# Altium schematic sheet RF.SchDoc: RF
size A4; ApprovedBy: Maduranga Mathara Arachchi; CheckedBy: Maduranga Mathara Arachchi; Author: Maduranga Mathara Arachchi; CompanyName: Maduranga Mathara Arachchi; DrawnBy: Maduranga Mathara Arachchi; Engineer: Maduranga Mathara Arachchi; Organization: Maduranga Mathara Arachchi; Address1: 17/21, Gnanawimala Road,; Address2: Athurugiriya; Address3: Colombo,; Address4: Sri Lanka.; DocumentNumber: 1; Revision: 0.1; SheetNumber: 7; SheetTotal: 7
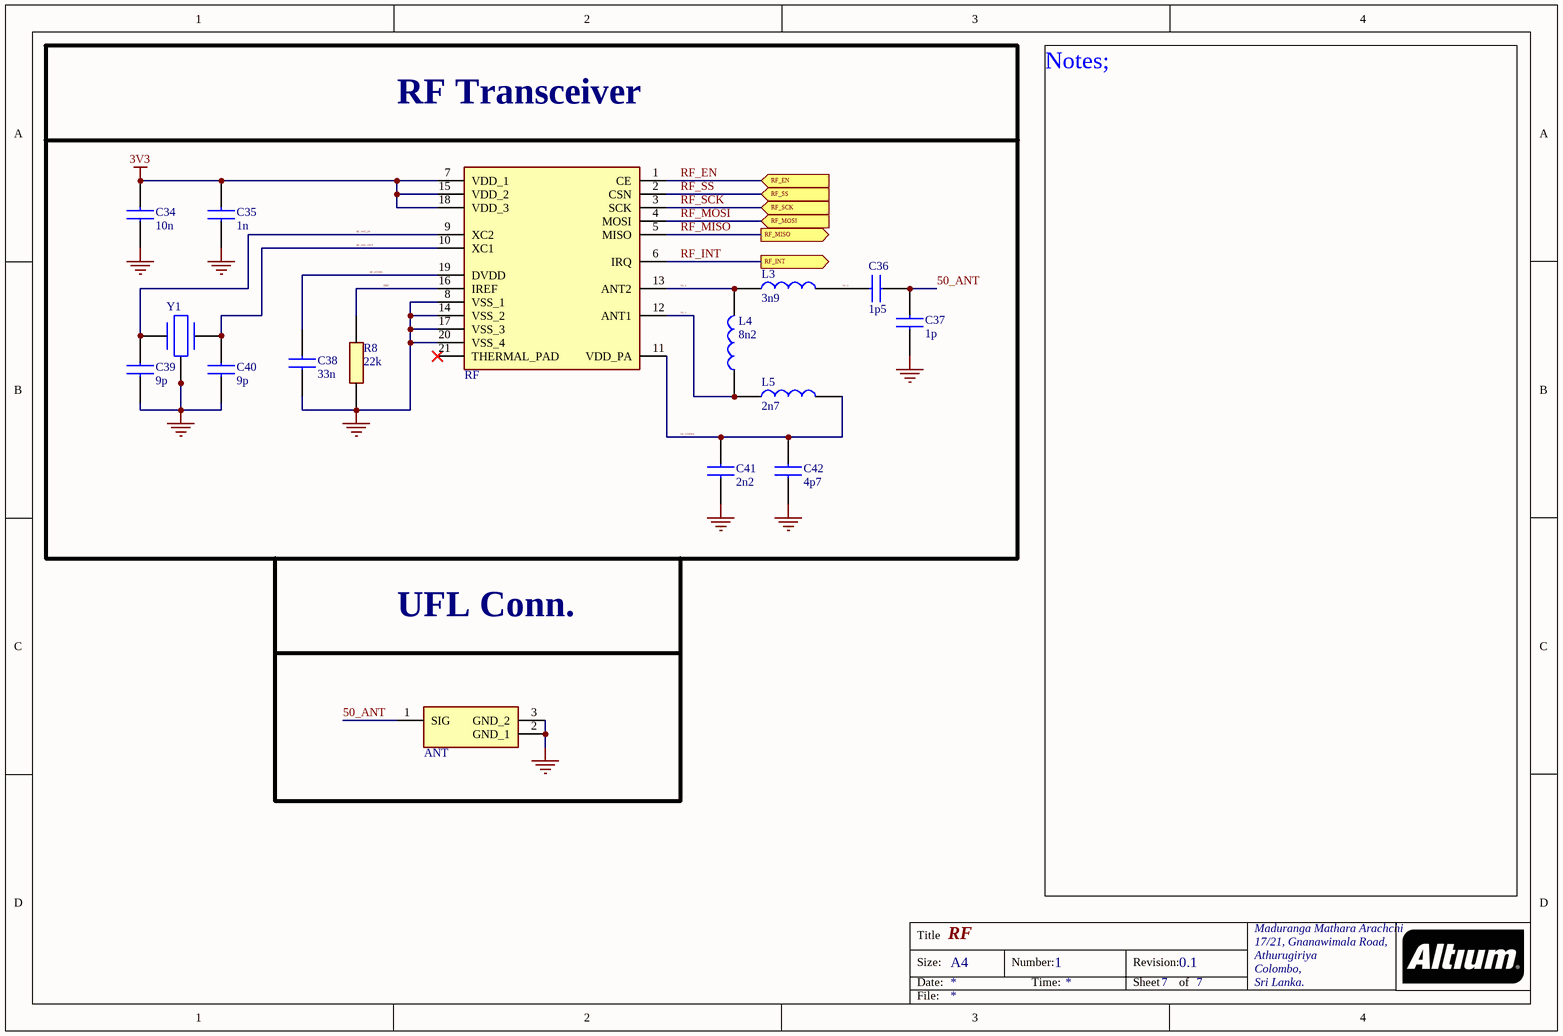
[diagram p0: RF.SchDoc]

## Parts
ANT  CONUFL001-SMD-T  [CONUFL001SMDT]  (value not drawn)
C34  10n  [C0402C104J4RACTU]
C35  1n  [C0402C104J4RACTU]
C36  1p5  [CAPC1005X70N]
C37  1p  [CAPC1005X70N]
C38  33n  [CAPC1005X70N]
C39  9p  [CAPC1005X70N]
C40  9p  [CAPC1005X70N]
C41  2n2  [CAPC1005X56N]
C42  4p7  [CAPC1005X70N]
L3  3n9  [LQW15AN10NG80D]
L4  8n2  [LQG15WH0N7B02D]
L5  2n7  [LQW15CNR20J00B]
R8  22k  [ERJ2RKD1004X]
RF  NRF24L01P-R7  [QFN50P400X400X95-21N-D]  (value not drawn)
Y1  TSX-3225_16.0000MF18X-AC0  [TSX3225160000MF18XAC0]  (value not drawn)

## Blocks framed on the sheet
RF Transceiver: C34-C42 L3-L5 R8 RF Y1

## Ports
RF_EN (in), RF_INT (out), RF_MISO (out), RF_MOSI (in), RF_SCK (in), RF_SS (in)

## Nets
3V3: C34.2 C35.2 RF.7(VDD_1) RF.15(VDD_2) RF.18(VDD_3)
GND: ANT.2(GND_1) ANT.3(GND_2) C34.1 C35.1 C37.1 C38.1 C39.1 C40.1 C41.1 C42.1 R8.1 RF.8(VSS_1) RF.14(VSS_2) RF.17(VSS_3) RF.20(VSS_4) Y1.2(GND_1) Y1.4(GND_2)
50_1: L4.1 L5.1 RF.12(ANT1)
50_2: L3.1 L4.2 RF.13(ANT2)
50_3: C36.1 L3.2
50_ANT: ANT.1(SIG) C36.2 C37.2
50_VDDPA: C41.2 C42.2 L5.2 RF.11(VDD_PA)
IREF: R8.2 RF.16(IREF)
RF_DVDD: C38.2 RF.19(DVDD)
RF_EN: RF.1(CE) ; port RF_EN
RF_INT: RF.6(IRQ) ; port RF_INT
RF_MISO: RF.5(MISO) ; port RF_MISO
RF_MOSI: RF.4(MOSI) ; port RF_MOSI
RF_OSC_IN: C39.2 RF.9(XC2) Y1.1(CRYSTAL_1)
RF_OSC_OUT: C40.2 RF.10(XC1) Y1.3(CRYSTAL_2)
RF_SCK: RF.3(SCK) ; port RF_SCK
RF_SS: RF.2(CSN) ; port RF_SS

Not connected (* = marked no-connect by the designer): RF 21(THERMAL_PAD)*

## Notes on the sheet
- UFL Conn.
- Notes;
- Title
- Size:
- Date:
- A4
- Number:
- Time:
- Revision:
- Sheet
- of
- File:

## Library data of the parts
ANT = CONUFL001-SMD-T: Connector; Manufacturer_Name: TE Connectivity; Datasheet Link: https://eu.mouser.com/datasheet/2/418/9/ENG_DS_CONUFL001_SMD_T_B-3238717.pdf; Height: 1.3mm; Manufacturer_Part_Number: CONUFL001-SMD-T; Mouser Part Number: N/A; Mouser Price/Stock: https://www.mouser.co.uk/ProductDetail/TE-Connectivity/CONUFL001-SMD-T?qs=3Rah4i%252BhyCHmRzMH%252BkLkPQ%3D%3D; Arrow Part Number: CONUFL001-SMD-T; Arrow Price/Stock: https://www.arrow.com/en/products/conufl001-smd-t/te-connectivity?utm_currency=USD&region=europe
C34 = C0402C103K3RECTU: Capacitor; Manufacturer_Name: KEMET; Datasheet Link: https://content.kemet.com/datasheets/KEM_C1002_X7R_SMD.pdf; Height: 0.55mm; Manufacturer_Part_Number: C0402C103K3RECTU
C35 = C0402C102K3RAC: Capacitor; Manufacturer_Name: KEMET; Datasheet Link: https://content.kemet.com/datasheets/KEM_C1002_X7R_SMD.pdf; Height: 0.55mm; Manufacturer_Part_Number: C0402C102K3RAC; Mouser Part Number: 80-C0402C102K3RAC; Mouser Price/Stock: https://www.mouser.co.uk/ProductDetail/KEMET/C0402C102K3RAC?qs=zlI8QACJnq%252BQ2zM2nES6Og%3D%3D; Arrow Part Number: C0402C102K3RAC; Arrow Price/Stock: https://www.arrow.com/en/products/c0402c102k3rac/kemet-corporation
C36 = GRM1555C1E1R5BA01D: Capacitor; Manufacturer_Name: Murata Electronics; Datasheet Link: https://search.murata.co.jp/Ceramy/image/img/A01X/G101/ENG/GRM1555C1E1R5BA01-01A.pdf; Height: 0.7mm; Manufacturer_Part_Number: GRM1555C1E1R5BA01D; Arrow Part Number: GRM1555C1E1R5BA01D; Arrow Price/Stock: https://www.arrow.com/en/products/grm1555c1e1r5ba01d/murata-manufacturing
C37 = GRM1555C1E1R0BA01D: Capacitor; Manufacturer_Name: Murata Electronics; Datasheet Link: https://search.murata.co.jp/Ceramy/image/img/A01X/G101/ENG/GRM1555C1E1R0BA01-01A.pdf; Height: 0.7mm; Manufacturer_Part_Number: GRM1555C1E1R0BA01D; Mouser Part Number: 81-GRM1555C1E1R0BA1D; Mouser Price/Stock: https://www.mouser.com/Search/Refine.aspx?Keyword=81-GRM1555C1E1R0BA1D; Arrow Part Number: GRM1555C1E1R0BA01D; Arrow Price/Stock: https://www.arrow.com/en/products/grm1555c1e1r0ba01d/murata-manufacturing
C38 = GRM155R71E333KA88D: Capacitor; Manufacturer_Name: Murata Electronics; Datasheet Link: https://search.murata.co.jp/Ceramy/image/img/A01X/G101/ENG/GRM155R71E333KA88-01A.pdf; Height: 0.7mm; Manufacturer_Part_Number: GRM155R71E333KA88D; Mouser Part Number: 81-GRM155R71E333KA8D; Mouser Price/Stock: https://www.mouser.com/Search/Refine.aspx?Keyword=81-GRM155R71E333KA8D; Arrow Part Number: GRM155R71E333KA88D; Arrow Price/Stock: https://www.arrow.com/en/products/grm155r71e333ka88d/murata-manufacturing?region=nac
C39 C40 = GRM1555C1E9R0WA01J: Capacitor; Manufacturer_Name: Murata Electronics; Datasheet Link: http://www.murata.com/~/media/webrenewal/support/library/catalog/products/capacitor/mlcc/c02e.pdf; Height: 0.7mm; Manufacturer_Part_Number: GRM1555C1E9R0WA01J
C41 = 04023C222KAT2A: Capacitor; Manufacturer_Name: Kyocera AVX; Datasheet Link: http://www.mouser.com/catalog/supplier/library/pdf/AVXSurfaceMountCeramic.pdf; Height: 0.56mm; Manufacturer_Part_Number: 04023C222KAT2A; Mouser Part Number: 581-04023C222KAT2A; Mouser Price/Stock: https://www.mouser.co.uk/ProductDetail/KYOCERA-AVX/04023C222KAT2A?qs=KeJ6wBBJrrorroMRPCeIVQ%3D%3D; Arrow Part Number: 04023C222KAT2A; Arrow Price/Stock: https://www.arrow.com/en/products/04023c222kat2a/avx?utm_currency=USD&region=nac
C42 = GRM1555C1E4R7BA01D: Capacitor; Manufacturer_Name: Murata Electronics; Datasheet Link: https://search.murata.co.jp/Ceramy/image/img/A01X/G101/ENG/GRM1555C1E4R7BA01-01A.pdf; Height: 0.7mm; Manufacturer_Part_Number: GRM1555C1E4R7BA01D; Mouser Part Number: 81-GRM1555C1E4R7BA1D; Mouser Price/Stock: https://www.mouser.co.uk/ProductDetail/Murata-Electronics/GRM1555C1E4R7BA01D?qs=ouTquLLW2S4mxqzIU81JVw%3D%3D; Arrow Part Number: GRM1555C1E4R7BA01D; Arrow Price/Stock: https://www.arrow.com/en/products/grm1555c1e4r7ba01d/murata-manufacturing?region=nac
L3 = LQW15AN3N9G80D: Inductor; Manufacturer_Name: Murata Electronics; Datasheet Link: https://search.murata.co.jp/Ceramy/image/img/P02/JELF243A-0100.pdf; Height: 0.6mm; Manufacturer_Part_Number: LQW15AN3N9G80D; Mouser Part Number: 81-LQW15AN3N9G80D; Mouser Price/Stock: https://www.mouser.co.uk/ProductDetail/Murata-Electronics/LQW15AN3N9G80D?qs=QzBtWTOodeVJ47BgUNTlYA%3D%3D
L4 = LQG15HS8N2G02D: Inductor; Manufacturer_Name: Murata Electronics; Datasheet Link: https://search.murata.co.jp/Ceramy/image/img/P02/JELF243B-0010.pdf; Height: 0.6mm; Manufacturer_Part_Number: LQG15HS8N2G02D; Mouser Part Number: 81-LQG15HS8N2G02D; Mouser Price/Stock: https://www.mouser.co.uk/ProductDetail/Murata-Electronics/LQG15HS8N2G02D?qs=d0WKAl%252BL4KapDveqKJ4FDA%3D%3D
L5 = LQW15AN2N7G8ZD: Inductor; Manufacturer_Name: Murata Electronics; Datasheet Link: https://search.murata.co.jp/Ceramy/image/img/P02/JELF243A-9138.pdf; Height: 0.6mm; Manufacturer_Part_Number: LQW15AN2N7G8ZD; Mouser Part Number: 81-LQW15AN2N7G8ZD; Mouser Price/Stock: https://www.mouser.com/Search/Refine.aspx?Keyword=81-LQW15AN2N7G8ZD
R8 = ERJ-2RKF2202X: Resistor; Manufacturer_Name: Panasonic; Datasheet Link: https://industrial.panasonic.com/cdbs/www-data/pdf/RDA0000/AOA0000C86.pdf; Height: 0.4mm; Manufacturer_Part_Number: ERJ-2RKF2202X; Mouser Part Number: 667-ERJ-2RKF2202X; Mouser Price/Stock: https://www.mouser.co.uk/ProductDetail/Panasonic/ERJ-2RKF2202X?qs=YMBIwoNQYdW1VNg8fYH1Ug%3D%3D; Arrow Part Number: ERJ-2RKF2202X; Arrow Price/Stock: https://www.arrow.com/en/products/erj-2rkf2202x/panasonic?region=europe
RF = NRF24L01P-R7: Integrated Circuit; Manufacturer_Name: Nordic Semiconductor; Datasheet Link: https://www.mouser.com/ds/2/297/nRF24L01P-1187709.pdf; Height: 0.95mm; Manufacturer_Part_Number: NRF24L01P-R7; Mouser Part Number: 949-NRF24L01P-R7; Mouser Price/Stock: https://www.mouser.co.uk/ProductDetail/Nordic-Semiconductor/nRF24L01P-R7?qs=yd0qOhnSiDe8zMRXiZkGiQ%3D%3D; Arrow Part Number: NRF24L01P-R7; Arrow Price/Stock: https://www.arrow.com/en/products/nrf24l01p-r7/nordic-semiconductor?utm_currency=USD&region=nac
Y1 = TSX-3225_16.0000MF18X-AC0: 16MHz Crystal; Manufacturer_Name: Epson Timing; Manufacturer_Part_Number: TSX-3225 16.0000MF18X-AC0; Datasheet Link: https://www.digikey.ph/en/products/detail/epson/TSX-3225-16-0000MF18X-AC0/5260855; Height: 0.6mm; Mouser Part Number: 732-322516F18XAC0; Mouser Price/Stock: https://www.mouser.co.uk/ProductDetail/Epson-Timing/TSX-3225-16.0000MF18X-AC0?qs=wwacUt%252BV97taurHtFwy%2FEA%3D%3D; Arrow Part Number: TSX-3225 16.0000MF18X-AC0; Arrow Price/Stock: https://www.arrow.com/en/products/tsx-322516.0000mf18x-ac0/epson-electronics-america?utm_currency=USD&region=nac